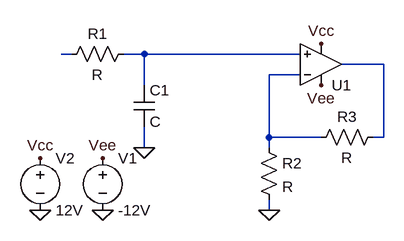
[diagram p0: schematic Active_Low_Pass.asc]
Active_Low_Pass.asc, the LTspice schematic file:
Version 4
SHEET 1 880 680
WIRE -32 192 -48 192
WIRE 80 192 48 192
WIRE 320 192 80 192
WIRE 448 208 384 208
WIRE 320 224 272 224
WIRE 80 240 80 192
WIRE 272 320 272 224
WIRE 352 320 272 320
WIRE 448 320 448 208
WIRE 448 320 432 320
WIRE 80 336 80 304
WIRE 272 336 272 320
WIRE 272 432 272 416
FLAG 352 176 Vcc
FLAG 352 240 Vee
FLAG 16 432 0
FLAG -80 432 0
FLAG -80 352 Vcc
FLAG 16 352 Vee
FLAG 80 336 0
FLAG 272 432 0
SYMBOL Opamps\\UniversalOpamp2 352 208 M180
SYMATTR InstName U1
SYMBOL voltage 16 336 R0
WINDOW 123 0 0 Left 2
WINDOW 39 0 0 Left 2
SYMATTR InstName V1
SYMATTR Value -12V
SYMBOL voltage -80 336 R0
WINDOW 123 0 0 Left 2
WINDOW 39 0 0 Left 2
SYMATTR InstName V2
SYMATTR Value 12V
SYMBOL res 64 176 R90
WINDOW 0 0 56 VBottom 2
WINDOW 3 32 56 VTop 2
SYMATTR InstName R1
SYMBOL cap 64 240 R0
SYMATTR InstName C1
SYMBOL res 256 320 R0
SYMATTR InstName R2
SYMBOL res 448 304 R90
WINDOW 0 0 56 VBottom 2
WINDOW 3 32 56 VTop 2
SYMATTR InstName R3

The netlist it stands for:
* Active_Low_Pass.asc
XU1 N002 N004 Vee Vcc N003 level.2 Avol=1Meg GBW=10Meg Slew=10Meg ilimit=25m rail=0 Vos=0 phimargin=45 en=0 enk=0 in=0 ink=0 Rin=500Meg  ; pins IN+ IN- V+ V- OUT
V1 Vee 0 -12V
V2 Vcc 0 12V
R1 N002 N001 R
C1 N002 0 C
R2 N004 0 R
R3 N003 N004 R
.lib UniversalOpamps2.sub
.backanno
.end